# EAGLE design board_0.4v (EAGLE 7.7.0)
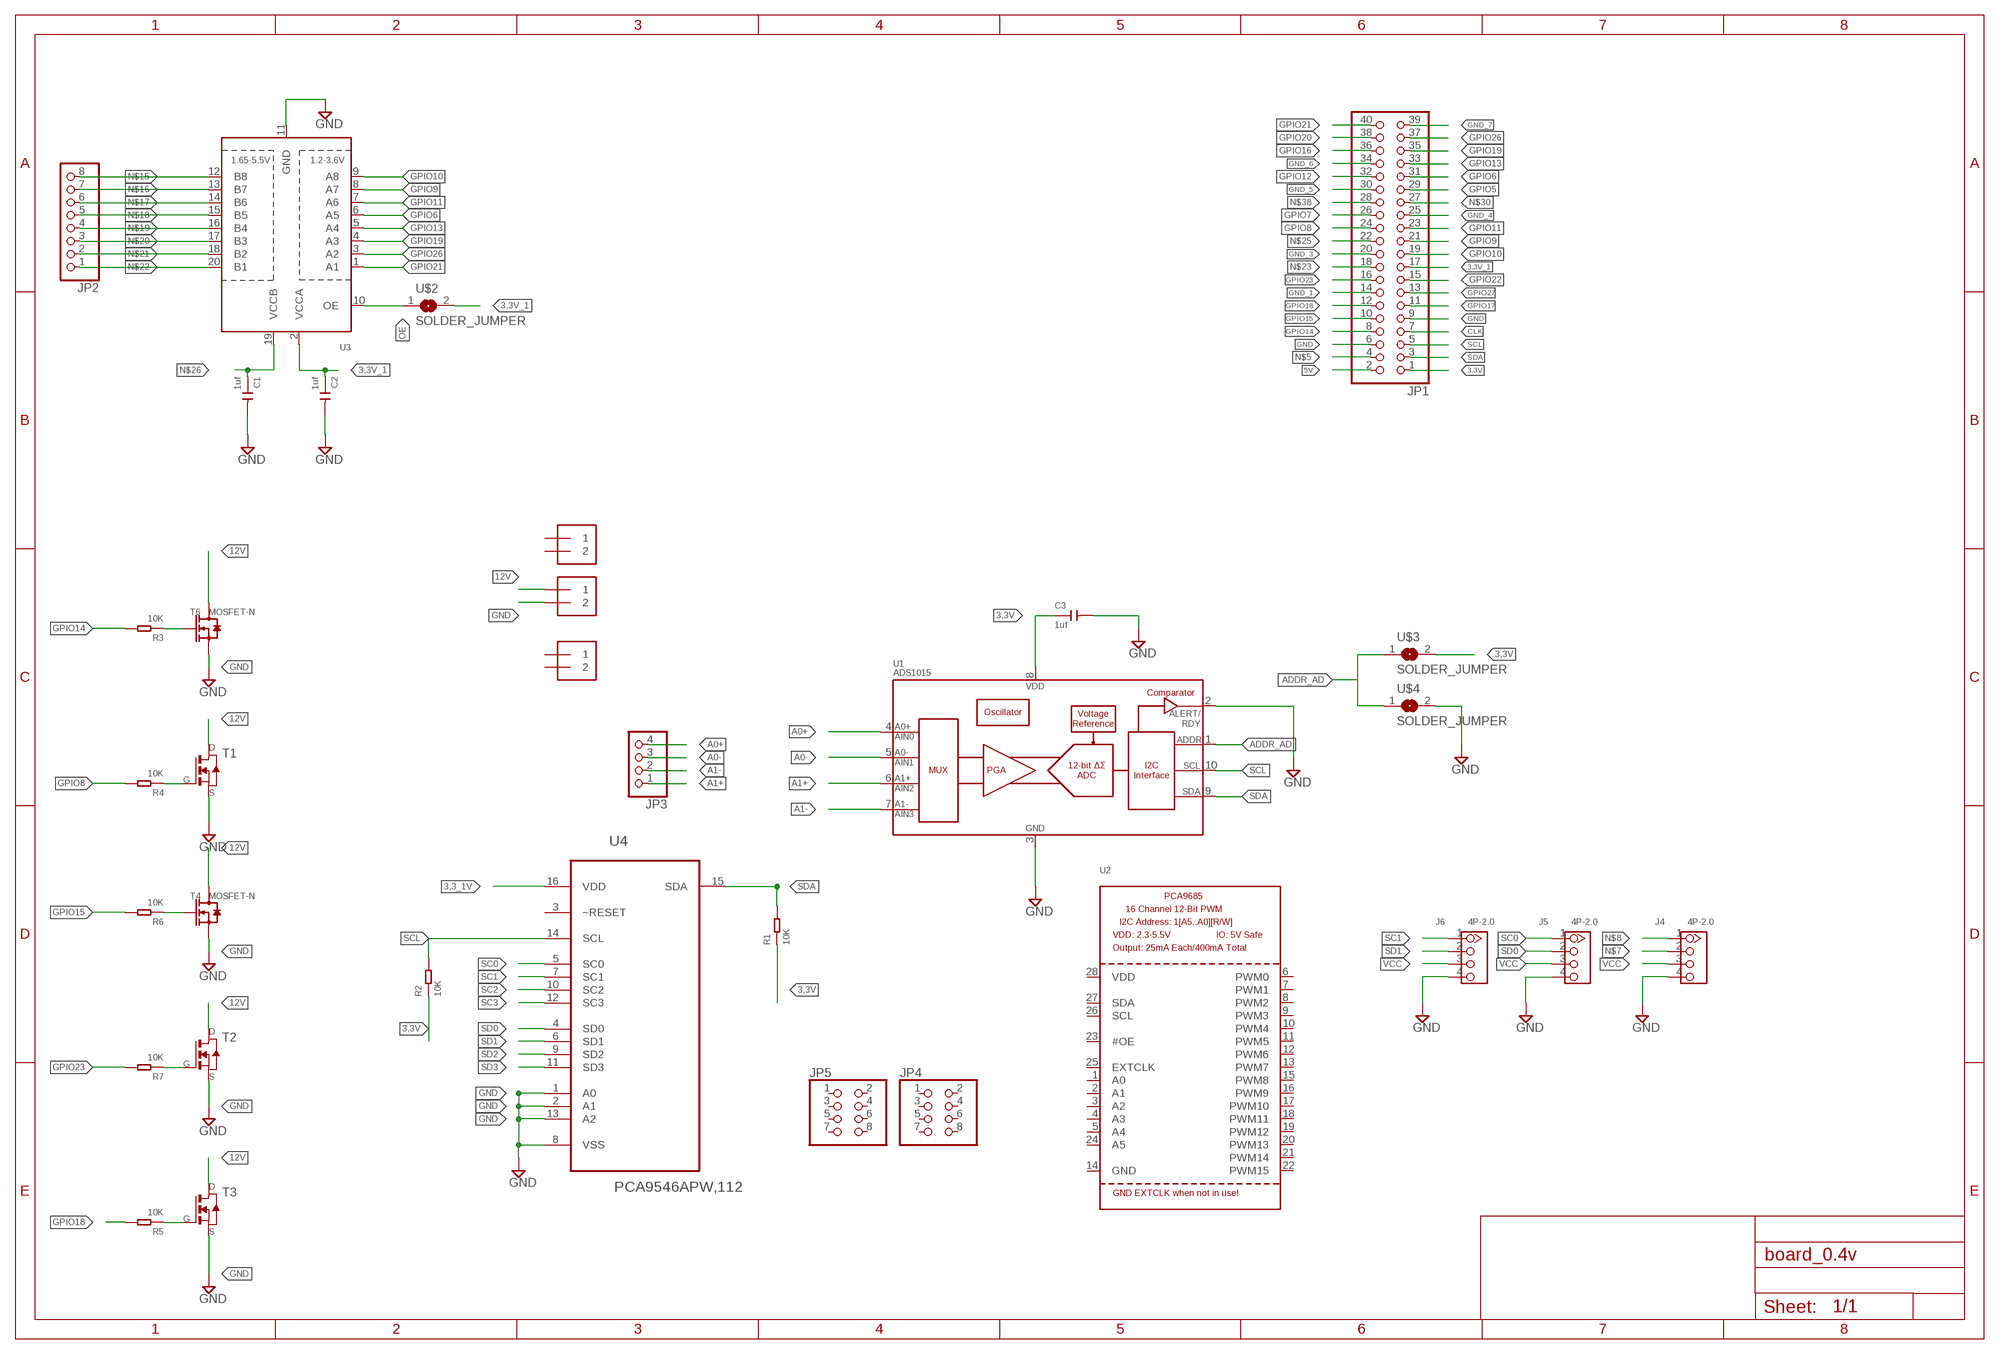
[diagram p0: schematic, sheet 1]

## Parts
C1  1uf  CERAMIC-1UF-25V-10%-X7R(0805)  [C0805]
C2  1uf  CERAMIC-1UF-25V-10%-X7R(0805)  [C0805]
C3  1uf  CERAMIC-1UF-25V-10%-X7R(0805)  [C0805]
J1  1X2-3.5MM  [1X2-3.5MM]
J2  1X2-3.5MM  [1X2-3.5MM]
J3  1X2-3.5MM  [1X2-3.5MM]
J4  4P-2.0  GROVE-CONNECTOR-DIP(4P-2.0)  [HW4-2.0]
J5  4P-2.0  GROVE-CONNECTOR-DIP(4P-2.0)  [HW4-2.0]
J6  4P-2.0  GROVE-CONNECTOR-DIP(4P-2.0)  [HW4-2.0]
JP1  PINHD-2X20  [2X20]
JP2  PINHD-1X8BIG  [1X08-BIG]
JP3  PINHD-1X4  [1X04]
JP4  PINHD-2X4  [2X04]
JP5  PINHD-2X4  [2X04]
R1  10K  SMD-RES-10K-1%-1/8W(0805)  [R0805]
R2  10K  SMD-RES-10K-1%-1/8W(0805)  [R0805]
R3  10K  SMD-RES-10K-1%-1/8W(0805)  [R0805]
R4  10K  SMD-RES-10K-1%-1/8W(0805)  [R0805]
R5  10K  SMD-RES-10K-1%-1/8W(0805)  [R0805]
R6  10K  SMD-RES-10K-1%-1/8W(0805)  [R0805]
R7  10K  SMD-RES-10K-1%-1/8W(0805)  [R0805]
T1  NMOSFETTO252  [TO252]
T2  NMOSFETTO252  [TO252]
T3  NMOSFETTO252  [TO252]
T4  MOSFET-N  [SOT-23]
T6  MOSFET-N  [SOT-23]
U1  ADS1015  [MSOP10]
U2  PCA9685  [TSSOP28]
U3  TXB0108PWR  [TSSOP20]
U4  PCA9546APW,112  [SOP65P640X110-16N]
U$2  SOLDER_JUMPER  [SJFAB]
U$3  SOLDER_JUMPER  [SJFAB]
U$4  SOLDER_JUMPER  [SJFAB]

## Nets
3,3_1V: U4.16(VDD)
3,3V: C3.1 JP1.1 R1.1 R2.1 U1.8(VDD) U$3.2
3,3V_1: C2.1 JP1.17 U3.2(VCCA) U$2.2
5V: JP1.2
12V: J2.1 T1.3(D) T2.3(D) T3.3(D) T4.3(D) T6.3(D)
A0+: JP3.4 U1.4(AIN0)
A0-: JP3.3 U1.5(AIN1)
A1+: JP3.1 U1.6(AIN2)
A1-: JP3.2 U1.7(AIN3)
ADDR_AD: U1.1(ADDR) U$3.1 U$4.1
CLK: JP1.7
GND: C1.2 C2.2 C3.2 J2.2 J4.4 J5.4 J6.4 JP1.6 JP1.9 T1.2(S) T2.2(S) T3.2(S) T4.2(S) T6.2(S) U1.2(ALERT/RDY) U1.3(VSS) U3.11(GND) U4.1(A0) U4.2(A1) U4.8(VSS) U4.13(A2) U$4.2
GND_1: JP1.14
GND_3: JP1.20
GND_4: JP1.25
GND_5: JP1.30
GND_6: JP1.34
GND_7: JP1.39
GPIO5: JP1.29
GPIO6: JP1.31 U3.6(A5)
GPIO7: JP1.26
GPIO8: JP1.24 R4.2
GPIO9: JP1.21 U3.8(A7)
GPIO10: JP1.19 U3.9(A8)
GPIO11: JP1.23 U3.7(A6)
GPIO12: JP1.32
GPIO13: JP1.33 U3.5(A4)
GPIO14: JP1.8 R3.2
GPIO15: JP1.10 R6.2
GPIO16: JP1.36
GPIO17: JP1.11
GPIO18: JP1.12 R5.2
GPIO19: JP1.35 U3.4(A3)
GPIO20: JP1.38
GPIO21: JP1.40 U3.1(A1)
GPIO22: JP1.15
GPIO23: JP1.16 R7.2
GPIO26: JP1.37 U3.3(A2)
GPIO27: JP1.13
N$5: JP1.4
N$6: R3.1 T6.1(G)
N$7: J4.2
N$8: J4.1
N$9: R4.1 T1.1(G)
N$10: R6.1 T4.1(G)
N$11: R7.1 T2.1(G)
N$12: R5.1 T3.1(G)
N$15: JP2.8 U3.12(B8)
N$16: JP2.7 U3.13(B7)
N$17: JP2.6 U3.14(B6)
N$18: JP2.5 U3.15(B5)
N$19: JP2.4 U3.16(B4)
N$20: JP2.3 U3.17(B3)
N$21: JP2.2 U3.18(B2)
N$22: JP2.1 U3.20(B1)
N$23: JP1.18
N$25: JP1.22
N$26: C1.1 U3.19(VCCB)
N$30: JP1.27
N$38: JP1.28
OE: U3.10(OE) U$2.1
SC0: J5.1 U4.5(SC0)
SC1: J6.1 U4.7(SC1)
SC2: U4.10(SC2)
SC3: U4.12(SC3)
SCL: JP1.5 R2.2 U1.10(SCL) U4.14(SCL)
SD0: J5.2 U4.4(SD0)
SD1: J6.2 U4.6(SD1)
SD2: U4.9(SD2)
SD3: U4.11(SD3)
SDA: JP1.3 R1.2 U1.9(SDA) U4.15(SDA)
VCC: J4.3 J5.3 J6.3
Unconnected: J1.1 J1.2 J3.1 J3.2 JP4.1 JP4.2 JP4.3 JP4.4 JP4.5 JP4.6 JP4.7 JP4.8 JP5.1 JP5.2 JP5.3 JP5.4 JP5.5 JP5.6 JP5.7 JP5.8 U2.1(A0) U2.2(A1) U2.3(A2) U2.4(A3) U2.5(A4) U2.6(PWM0) U2.7(PWM1) U2.8(PWM2) U2.9(PWM3) U2.10(PWM4) U2.11(PWM5) U2.12(PWM6) U2.13(PWM7) U2.15(PWM8) U2.16(PWM9) U2.17(PWM10) U2.18(PWM11) U2.19(PWM12) U2.20(PWM13) U2.21(PWM14) U2.22(PWM15) U2.23(#OE) U2.24(A5) U2.25(EXTCLK) U2.26(SCL) U2.27(SDA) U4.3(~RESET)

## Power pins joined to a net without a drawn wire
GND: U2.14(GND)
VDD: U2.28(VDD)

## Library data of the parts
C1-C3 = Seeed-OPL-Capacitor:CERAMIC-1UF-25V-10%-X7R(0805): 302010179; MPN: CC0805KKX7R8BB105
J1-J3 = adafruit:1X2: 3.5mm Terminal block http://www.ladyada.net/library/pcb/eaglelibrary.html
J4-J6 = Seeed-OPL-Connector:GROVE-CONNECTOR-DIP(4P-2.0): 320110033
JP1 = adafruit:PINHD-2X20: PIN HEADER
JP2 = adafruit:PINHD-1X8: PIN HEADER
JP3 = pinhead:PINHD-1X4: PIN HEADER
JP4 JP5 = adafruit:PINHD-2X4: PIN HEADER
R1-R7 = Seeed-OPL-Resistor:SMD-RES-10K-1%-1/8W(0805): 301010361; MPN: RC0805FR-0710KL
T1-T3 = fab_2:NMOSFET: MOS FET
T4 T6 = Seeed-OPL-Transistor:MOSFET-N
U1 = SparkFun-IC-Conversion:ADS1015: ADS1015 12-BIT ADC 12-Bit Del-Sig ADC Four single-ended inputs or two differential inputs Internal PGA I2C interface 2.0-5.5V SparkFun Products SparkFun Block for Intel Edison - ADC <https://www.sparkfun.com/products/13770> (DEV-13770); PROD_ID: IC-12270
U2 = adafruit:PCA9685: PCA9685 - 16 Channel 12-Bit I2C PWM Controller 5.0V tolerant 16 channel, 12-bit I2C PWM controller with 25mA per output (max. 400mA total) Digikey: 568-5931-1-ND
U3 = adafruit:TXB0108PWR: 8-Bit Bi-Directional Level Shifter 1.2V-3.6V (VCCA) to 1.65V-5.5V (VCCB) bi-directional level shifter with auto direction sensing. Max data rate - VCCA 1.8V: 20Mbps (50ns), VCCA 3.3V: 100Mbps (10ns) Digikey: 296-21527-1-ND
U4 = NXP_By_element14_Batch_1:PCA9546APW,112: 4-channel I2C-bus switch with reset; MPN: PCA9546APW,112; OC_FARNELL: 1831208; OC_NEWARK: 70R6610; PACKAGE: TSSOP-16; SUPPLIER: NXP
U$2-U$4 = fab:SOLDER_JUMPER

## Board
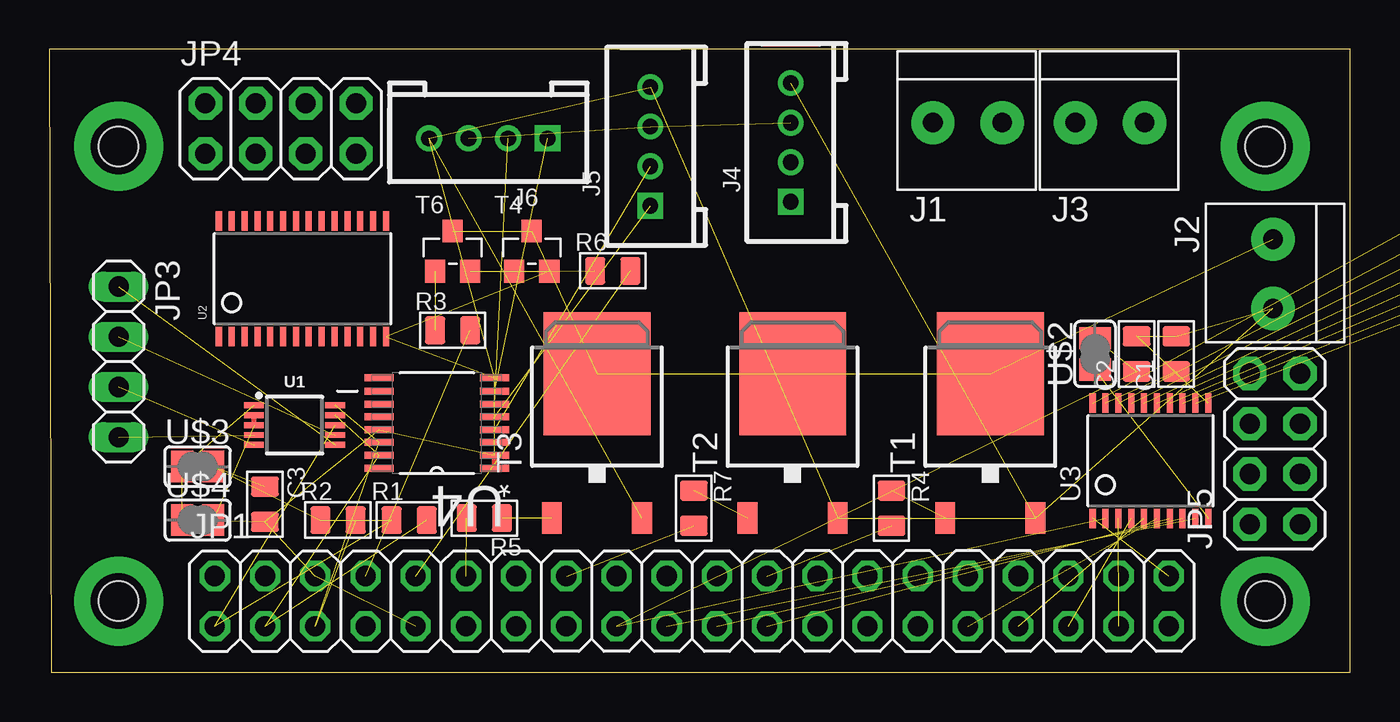
[diagram p1: board, top side]

Size 65.8 x 31.5 mm. Coordinates in mm from the lower left corner, seen from the top.
Outline: 0.1,0 65.8,0 65.8,31.5 0,31.5 0.1,0
Copper layers (1*16): Top 0.035mm / dielectric 1.5mm / Bottom 0.035mm
Design rules "default": minimum track width 10mil, minimum drill 24mil, track to track 8mil, track to pad 8mil, pad to pad 8mil, via to via 8mil, smd to smd 8mil, copper to edge 40mil, drill to drill 8mil, minimum pad ring 10mil, minimum via ring 8mil, stop-mask expansion 4mil, vias tented up to drill 0mil, thermal gap 10mil
Holes 2 mm at 3.5,26.6 3.5,3.6 61.5,26.6 61.5,3.6

### Footprints (pad centres in the part's own frame; a part is rotated, then mirrored left to right if it is on the bottom)
C0805 = smd 1.397 x 1.016: 1 0,0.889; 2 0,-0.889
1X2-3.5MM = drill 1 pad 2.184: 1 1.8,0; 2 -1.7,0
HW4-2.0 = drill 0.8 pad 1.27 square: 1 -3,0 | drill 0.8 pad 1.27: 2 -1,0; 3 1,0; 4 3,0
2X20 = drill 1.016 octagon: 1 -24.13,-1.27; 2 -24.13,1.27; 3 -21.59,-1.27; 4 -21.59,1.27; 5 -19.05,-1.27; 6 -19.05,1.27; 7 -16.51,-1.27; 8 -16.51,1.27; 9 -13.97,-1.27; 10 -13.97,1.27; 11 -11.43,-1.27; 12 -11.43,1.27; 13 -8.89,-1.27; 14 -8.89,1.27; 15 -6.35,-1.27; 16 -6.35,1.27; 17 -3.81,-1.27; 18 -3.81,1.27; 19 -1.27,-1.27; 20 -1.27,1.27; 21 1.27,-1.27; 22 1.27,1.27; 23 3.81,-1.27; 24 3.81,1.27; 25 6.35,-1.27; 26 6.35,1.27; 27 8.89,-1.27; 28 8.89,1.27; 29 11.43,-1.27; 30 11.43,1.27; 31 13.97,-1.27; 32 13.97,1.27; 33 16.51,-1.27; 34 16.51,1.27; 35 19.05,-1.27; 36 19.05,1.27; 37 21.59,-1.27; 38 21.59,1.27; 39 24.13,-1.27; 40 24.13,1.27
1X08-BIG = drill 1.016 pad 1.778 octagon: 1 -8.89,0; 2 -6.35,0; 3 -3.81,0; 4 -1.27,0; 5 1.27,0; 6 3.81,0; 7 6.35,0; 8 8.89,0
1X04 = drill 1.016 long: 1 -3.81,0; 2 -1.27,0; 3 1.27,0; 4 3.81,0
2X04 = drill 1.016 pad 1.676 octagon: 1 -3.81,-1.27; 2 -3.81,1.27; 3 -1.27,-1.27; 4 -1.27,1.27; 5 1.27,-1.27; 6 1.27,1.27; 7 3.81,-1.27; 8 3.81,1.27
R0805 = smd 1.397 x 1.016: 1 0,0.889; 2 0,-0.889
TO252 = smd 1 x 1.6: 1 -2.28,-4.8; 2 2.28,-4.8 | smd 5.4 x 6.2: 3 0,2.5
SOT-23 = smd 1.016 x 1.143: 1 -0.889,-1.016; 2 0.889,-1.016; 3 0,1.016
MSOP10 = smd 0.3 x 1: 1 -1,-2.05; 2 -0.5,-2.05; 3 0,-2.05; 4 0.5,-2.05; 5 1,-2.05; 6 1,2.05; 7 0.5,2.05; 8 0,2.05; 9 -0.5,2.05; 10 -1,2.05
TSSOP28 = smd 0.305 x 0.991: 1 -4.225,-2.918; 2 -3.575,-2.918; 3 -2.925,-2.918; 4 -2.275,-2.918; 5 -1.625,-2.918; 6 -0.975,-2.918; 7 -0.325,-2.918; 8 0.325,-2.918; 9 0.975,-2.918; 10 1.625,-2.918; 11 2.275,-2.918; 12 2.925,-2.918; 13 3.575,-2.918; 14 4.225,-2.918; 15 4.225,2.918; 16 3.575,2.918; 17 2.925,2.918; 18 2.275,2.918; 19 1.625,2.918; 20 0.975,2.918; 21 0.325,2.918; 22 -0.325,2.918; 23 -0.975,2.918; 24 -1.625,2.918; 25 -2.275,2.918; 26 -2.925,2.918; 27 -3.575,2.918; 28 -4.225,2.918
TSSOP20 = smd 0.305 x 0.991: 1 -2.925,-2.918; 2 -2.275,-2.918; 3 -1.625,-2.918; 4 -0.975,-2.918; 5 -0.325,-2.918; 6 0.325,-2.918; 7 0.975,-2.918; 8 1.625,-2.918; 9 2.275,-2.918; 10 2.925,-2.918; 11 2.925,2.918; 12 2.275,2.918; 13 1.625,2.918; 14 0.975,2.918; 15 0.325,2.918; 16 -0.325,2.918; 17 -0.975,2.918; 18 -1.625,2.918; 19 -2.275,2.918; 20 -2.925,2.918
SOP65P640X110-16N = smd 1.473 x 0.356: 1 -2.921,2.286; 2 -2.921,1.626; 3 -2.921,0.965; 4 -2.921,0.33; 5 -2.921,-0.33; 6 -2.921,-0.965; 7 -2.921,-1.626; 8 -2.921,-2.286; 9 2.921,-2.286; 10 2.921,-1.626; 11 2.921,-0.965; 12 2.921,-0.33; 13 2.921,0.33; 14 2.921,0.965; 15 2.921,1.626; 16 2.921,2.286
SJFAB = smd 1.118 x 1.6: 1 -0.787,0; 2 0.787,0

### Placement (x,y rotation side)
C1  57,16.1 180 top
C2  55,16.1 180 top
C3  10.9,8.5 0 top
J1  46.5,27.8 180 top
J2  61.9,20.1 90 top
J3  53.7,27.8 180 top
J4  37.5,26.8 90 top
J5  30.4,26.6 90 top
J6  22.2,27 180 top
JP1  32.5,3.6 0 top
JP2  91.2,29.9 0 top  (outside the outline)
JP3  3.5,15.7 270 top
JP4  11.7,27.5 0 top
JP5  62,11.3 90 top
R1  18.2,7.7 90 top
R2  14.6,7.7 90 top
R3  20.4,17.3 90 top
R4  42.6,8.3 0 top
R5  22,7.8 270 top
R6  28.5,20.3 90 top
R7  32.6,8.3 0 top
T1  47.6,12.6 0 top
T2  37.6,12.6 0 top
T3  27.7,12.6 0 top
T4  24.4,21.3 0 top
T6  20.4,21.3 0 top
U1  12.4,12.5 270 top
U2  12.8,19.9 0 top
U3  55.7,10.7 0 top
U4  19.6,12.6 180 top
U$2  52.9,16.1 90 top
U$3  7.5,10.4 0 top
U$4  7.5,7.7 0 top

### Tracks (layer width: path | path; a pad name or v marks a point on that pad's centre or on a via)
3,3V  (5 unrouted)
3,3V_1  (3 unrouted)
12V  (5 unrouted)
A0+  (1 unrouted)
A0-  (1 unrouted)
A1+  (1 unrouted)
A1-  (1 unrouted)
ADDR_AD  (2 unrouted)
GND  (20 unrouted)
  Top 0.254: U1.3 U1.2 | U4.1 U4.2
GPIO6  (1 unrouted)
GPIO8  (1 unrouted)
GPIO9  (1 unrouted)
GPIO10  (1 unrouted)
GPIO11  (1 unrouted)
GPIO13  (1 unrouted)
GPIO14  (1 unrouted)
GPIO15  (1 unrouted)
GPIO18  (1 unrouted)
GPIO19  (1 unrouted)
GPIO21  (1 unrouted)
GPIO23  (1 unrouted)
GPIO26  (1 unrouted)
N$1  (via drill 2.8 pad 4.5)
  other vias: 61.5,26.6
N$2  (via drill 2.8 pad 4.5)
  other vias: 3.5,26.6
N$3  (via drill 2.8 pad 4.5)
  other vias: 3.5,3.6
N$4  (via drill 2.8 pad 4.5)
  other vias: 61.5,3.6
N$6  (1 unrouted)
N$9  (1 unrouted)
N$10  (1 unrouted)
N$11  (1 unrouted)
N$12  (1 unrouted)
N$15  (1 unrouted)
N$16  (1 unrouted)
N$17  (1 unrouted)
N$18  (1 unrouted)
N$19  (1 unrouted)
N$20  (1 unrouted)
N$21  (1 unrouted)
N$22  (1 unrouted)
N$26  (1 unrouted)
OE  (1 unrouted)
SC0  (1 unrouted)
SC1  (1 unrouted)
SCL  (3 unrouted)
SD0  (1 unrouted)
SD1  (1 unrouted)
SDA  (3 unrouted)
VCC  (2 unrouted)

### Text on the board
Top: + Puertos | Conecto 12v / + pquenio | Reloj ? | Bridget | Regulador de 12 volts | Regulador de 6 volts